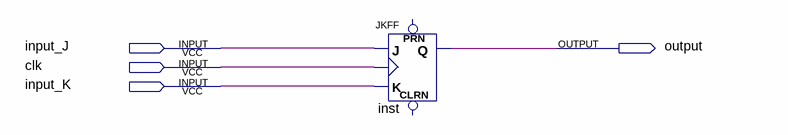
[diagram p0: schematic sheet]
// Quartus schematic ta2.bdf as structural Verilog: 1 symbols, 4 pins
module ta2 (
  input  input_J,
  input  clk,
  input  input_K,
  output \output 
);

  JKFF inst (.K(input_K), .J(input_J), .CLK(clk), .Q(\output ));  // open: PRN, CLRN
endmodule
